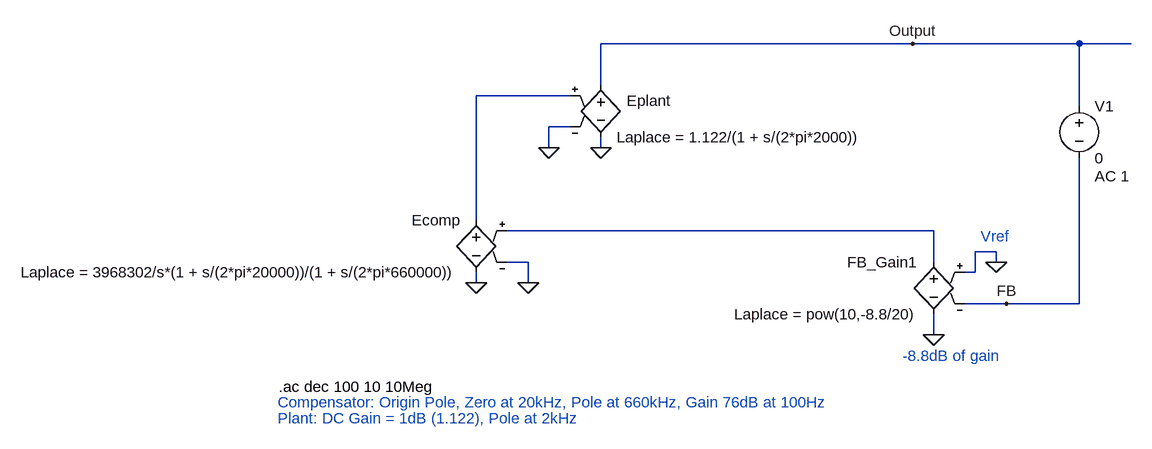
[diagram p0: schematic Classical_Feedback_Example_Bode.asc]
Classical_Feedback_Example_Bode.asc, the LTspice schematic file:
Version 4
SHEET 1 1312 696
WIRE 896 16 416 16
WIRE 1152 16 896 16
WIRE 1232 16 1152 16
WIRE 416 80 416 16
WIRE 368 96 224 96
WIRE 1152 112 1152 16
WIRE 368 144 336 144
WIRE 336 176 336 144
WIRE 416 176 416 160
WIRE 224 288 224 96
WIRE 928 304 272 304
WIRE 1024 336 992 336
WIRE 304 352 272 352
WIRE 928 352 928 304
WIRE 1024 352 1024 336
WIRE 992 368 992 336
WIRE 992 368 976 368
WIRE 224 384 224 368
WIRE 304 384 304 352
WIRE 1040 416 976 416
WIRE 1152 416 1152 192
WIRE 1152 416 1040 416
WIRE 928 464 928 432
FLAG 416 176 0
FLAG 896 16 Output
FLAG 224 384 0
FLAG 304 384 0
FLAG 1040 416 FB
FLAG 928 464 0
FLAG 1024 352 0
FLAG 336 176 0
SYMBOL e 224 272 M0
SYMATTR InstName Ecomp
SYMATTR Value Laplace = 3968302/s*(1 + s/(2*pi*20000))/(1 + s/(2*pi*660000))
SYMBOL e 416 64 R0
WINDOW 0 40 40 Left 2
SYMATTR InstName Eplant
SYMATTR Value Laplace = 1.122/(1 + s/(2*pi*2000))
SYMBOL voltage 1152 96 R0
WINDOW 123 24 124 Left 2
WINDOW 39 0 0 Left 0
SYMATTR Value2 AC 1
SYMATTR InstName V1
SYMATTR Value 0
SYMBOL e 928 336 M0
SYMATTR InstName FB_Gain1
SYMATTR Value Laplace = pow(10,-8.8/20)
TEXT -80 544 Left 2 !.ac dec 100 10 10Meg
TEXT -88 568 Left 2 ; Compensator: Origin Pole, Zero at 20kHz, Pole at 660kHz, Gain 76dB at 100Hz
TEXT -88 592 Left 2 ; Plant: DC Gain = 1dB (1.122), Pole at 2kHz
TEXT 880 496 Left 2 ;-8.8dB of gain
TEXT 1000 312 Left 2 ;Vref

The netlist it stands for:
* Classical_Feedback_Example_Bode.asc
Ecomp N001 0 N002 0 Laplace = 3968302/s*(1 + s/(2*pi*20000))/(1 + s/(2*pi*660000))
Eplant Output 0 N001 0 Laplace = 1.122/(1 + s/(2*pi*2000))
V1 Output FB 0 AC 1
E§FB_Gain1 N002 0 0 FB Laplace = pow(10,-8.8/20)
.ac dec 100 10 10Meg
*  Compensator: Origin Pole, Zero at 20kHz, Pole at 660kHz, Gain 76dB at 100Hz
*  Plant: DC Gain = 1dB (1.122), Pole at 2kHz
* -8.8dB of gain
* Vref
.backanno
.end